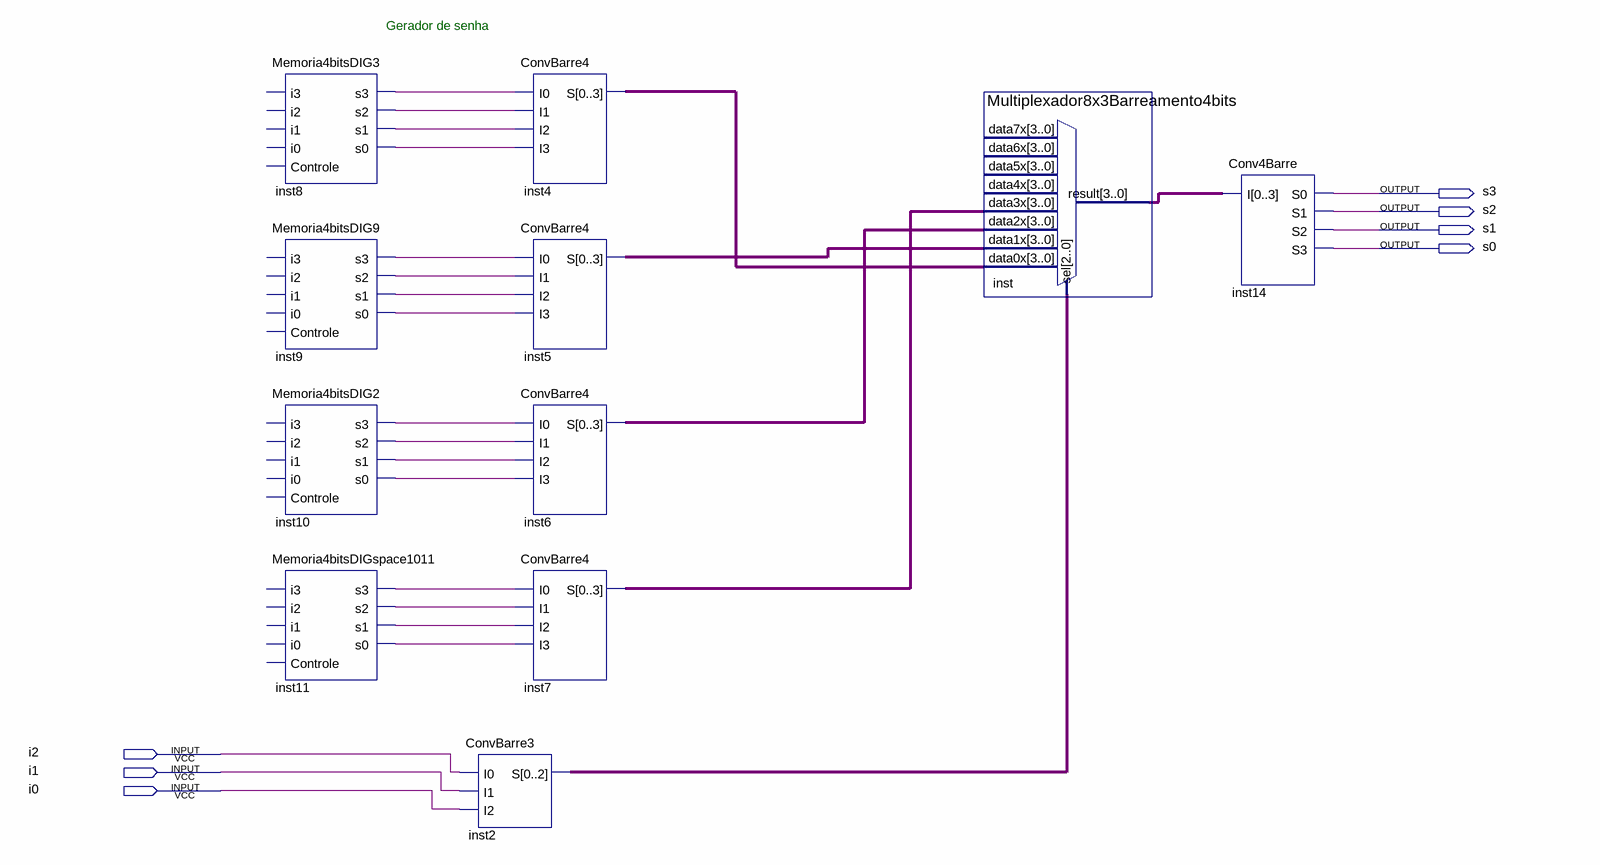
[diagram p0: schematic sheet]
// Quartus schematic Gerador.bdf as structural Verilog: 11 symbols, 7 pins
module Gerador (
  input  i2,
  input  i1,
  input  i0,
  output s3,
  output s2,
  output s1,
  output s0
);

  wire inst8_s0, inst8_s1, inst8_s2, inst8_s3, inst9_s0, inst9_s1, inst9_s2, inst9_s3, inst10_s0, inst10_s1,
       inst10_s2, inst10_s3, inst11_s0, inst11_s1, inst11_s2, inst11_s3;
  wire [2:0] inst2_s;
  wire [3:0] inst4_s, inst5_s, inst6_s, inst7_s, inst_result;

  Memoria4bitsDIG3 inst8 (
    .s3(inst8_s3), .s2(inst8_s2), .s1(inst8_s1), .s0(inst8_s0));  // open: i3, i2, i1, i0, Controle
  Memoria4bitsDIG9 inst9 (
    .s3(inst9_s3), .s2(inst9_s2), .s1(inst9_s1), .s0(inst9_s0));  // open: i3, i2, i1, i0, Controle
  Memoria4bitsDIG2 inst10 (
    .s3(inst10_s3), .s2(inst10_s2), .s1(inst10_s1), .s0(inst10_s0));  // open: i3, i2, i1, i0, Controle
  Memoria4bitsDIGspace1011 inst11 (
    .s3(inst11_s3), .s2(inst11_s2), .s1(inst11_s1), .s0(inst11_s0));  // open: i3, i2, i1, i0, Controle
  ConvBarre3 inst2 (.I0(i2), .I1(i1), .I2(i0), .S(inst2_s));
  ConvBarre4 inst4 (.I0(inst8_s3), .I1(inst8_s2), .I2(inst8_s1), .I3(inst8_s0), .S(inst4_s));
  ConvBarre4 inst5 (.I0(inst9_s3), .I1(inst9_s2), .I2(inst9_s1), .I3(inst9_s0), .S(inst5_s));
  ConvBarre4 inst6 (.I0(inst10_s3), .I1(inst10_s2), .I2(inst10_s1), .I3(inst10_s0), .S(inst6_s));
  ConvBarre4 inst7 (.I0(inst11_s3), .I1(inst11_s2), .I2(inst11_s1), .I3(inst11_s0), .S(inst7_s));
  Multiplexador8x3Barreamento4bits inst (
    .data3x(inst7_s), .data2x(inst6_s), .data1x(inst5_s), .data0x(inst4_s), .sel(inst2_s),
    .result(inst_result));  // open: data7x, data6x, data5x, data4x
  Conv4Barre inst14 (.I(inst_result), .S0(s3), .S1(s2), .S2(s1), .S3(s0));

  // Notes on the sheet:
  //   Gerador de senha
endmodule
